# EasyEDA Pro project comparatorVCO.eprj, board PCB2
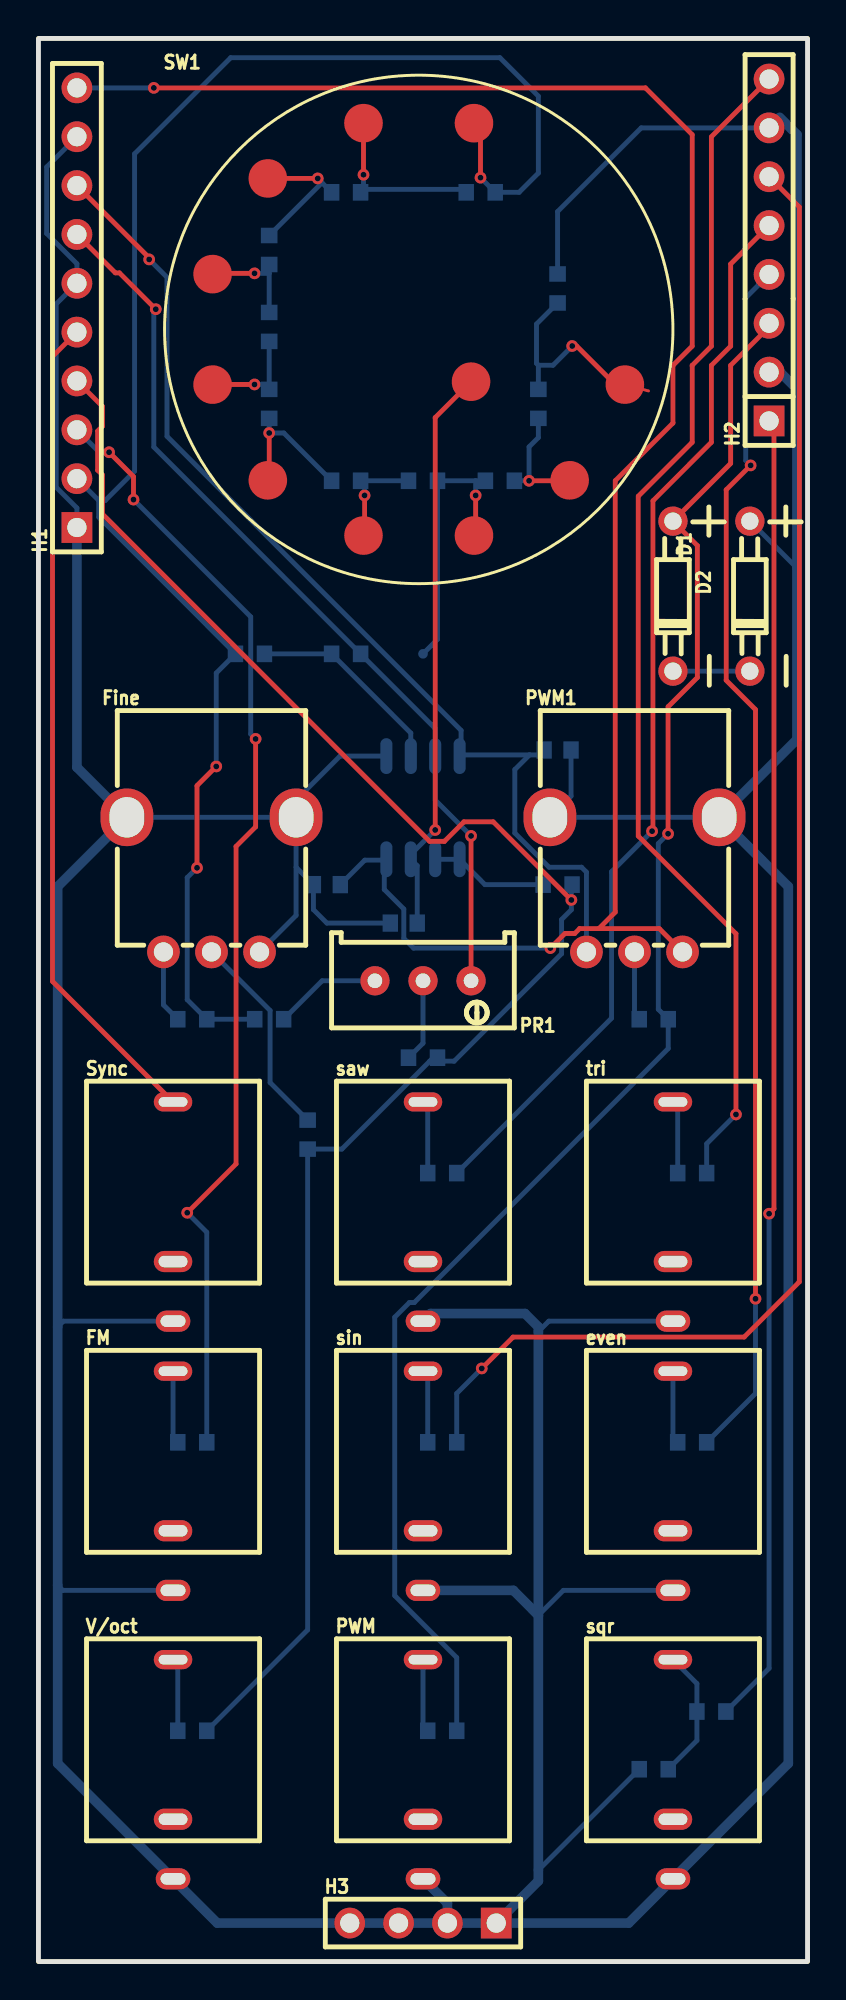
[diagram p6: board, top side]
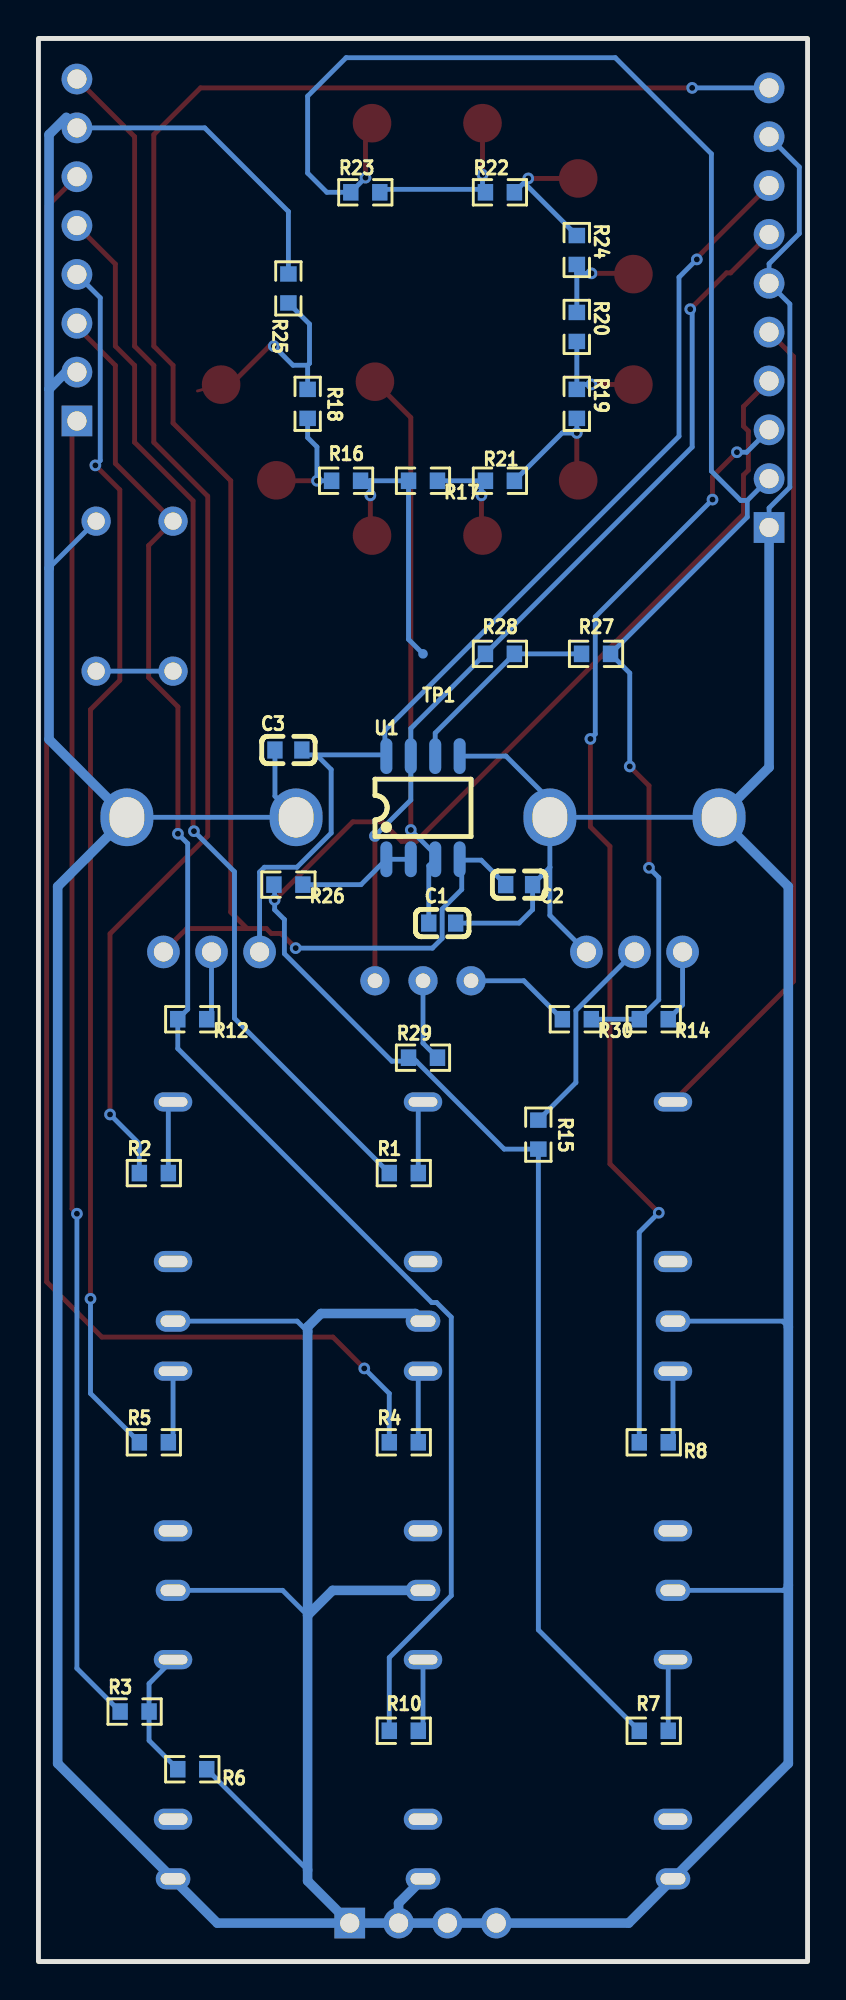
[diagram p7: board, bottom side, seen from below]

Outline 40 x 100 mm; copper layers: Top Layer, Bottom Layer. Coordinates in mm from the lower left corner of the outline.
Outline path: rectangle 0,100 40,0
Stack: Top Layer 0.035mm / Dielectric1 1.51mm FR4 er 4.5 / Bottom Layer 0.035mm

## Design rules (mm)
template: Custom Config
spacing copperThickness1oz (default): track to track 0.102, other pairs 0.152 to 0.3
spacing copperThickness2oz: track to track 0.203, other pairs 0.152 to 0.3
track width copperThickness1oz (default): min 0.127, default 0.254, max 2.54
track width copperThickness2oz: min 0.203, default 0.254, max 2.54
differential pair differentialPair (default): width min 0.127, default 0.254, max 2.54; gap min 0.152, default 0.152
via viaSize (default): diameter min 0.5, default 0.61, max 10; hole min 0.3, default 0.305, max 6.3

## Placement (name value [footprint] x y rotation side)
C1  1nF  [C0603]  19 54 180 bottom
C2  100nF  [C0603]  15 56 0 bottom
C3  100nF  [C0603]  27 63 180 bottom
D1  BZX55C4V7-TAP  [DO-35_BD1.7-L3.8-P7.8-D0.5-FD]  33 71 270 top
D2  BZX55C4V7-TAP  [DO-35_BD1.7-L3.8-P7.8-D0.5-FD]  37 71 270 top
even  WQP-WQP518MA  [CONN-TH_WQP-WQP518MA]  33 25 0 top
Fine  100kΩ  [RES-ADJ-TH_RK09D1130C3C]  9 56 0 top
FM  WQP-WQP518MA  [CONN-TH_WQP-WQP518MA]  7 25 0 top
H1  HTSW-110-07-G-S  [HDR-TH_TSW-110-17-F-S-LL]  2 86 90 top
H2  HTSW-108-22-T-S  [HDR-TH_HTSW-108-22-T-S]  38 89 90 top
H3  HTSW-104-18-F-S  [HDR-TH_HTSW-104-25-S-S-LL]  20 2 0 top
PR1  10kΩ  [RES-ADJ-TH_3P-L10.0-W10.0-P2.50-L]  20 51 180 top
PWM  WQP-WQP518MA  [CONN-TH_WQP-WQP518MA]  20 10 0 top
PWM1  100kΩ  [RES-ADJ-TH_RK09D1130C3C]  31 56 0 top
R1  1k  [R0603]  21 41 180 bottom
R2  1k  [R0603]  34 41 180 bottom
R3  3.3k  [R0603]  35 13 180 bottom
R4  1k  [R0603]  21 27 180 bottom
R5  1k  [R0603]  34 27 180 bottom
R6  3.3k  [R0603]  32 10 0 bottom
R7  100k 0.1%  [R0603]  8 12 0 bottom
R8  100K  [R0603]  8 27 0 bottom
R10  47k  [R0603]  21 12 0 bottom
R12  12k  [R0603]  32 49 0 bottom
R14  130k  [R0603]  8 49 180 bottom
R15  100k  [R0603]  14 43 270 bottom
R16  120R 0.1%  [R0603]  24 77 0 bottom
R17  120R 0.1%  [R0603]  20 77 0 bottom
R18  120R 0.1%  [R0603]  26 81 90 bottom
R19  120R 0.1%  [R0603]  12 81 270 bottom
R20  120R 0.1%  [R0603]  12 85 270 bottom
R21  120R 0.1%  [R0603]  16 77 0 bottom
R22  120R 0.1%  [R0603]  16 92 180 bottom
R23  120R 0.1%  [R0603]  23 92 180 bottom
R24  120R 0.1%  [R0603]  12 89 270 bottom
R25  120R 0.1%  [R0603]  27 87 90 bottom
R26  50k .1%  [R0603]  27 56 0 bottom
R27  10K  [R0603]  11 68 0 bottom
R28  10K  [R0603]  16 68 0 bottom
R29  100k  [R0603]  20 47 180 bottom
R30  36k  [R0603]  12 49 0 bottom
saw  WQP-WQP518MA  [CONN-TH_WQP-WQP518MA]  20 39 0 top
sin  WQP-WQP518MA  [CONN-TH_WQP-WQP518MA]  20 25 0 top
sqr  WQP-WQP518MA  [CONN-TH_WQP-WQP518MA]  33 10 0 top
SW1  10polbryter, sjekk rett komponent  [A11003RNCQ_CNK]  30.5 82 0 top
Sync  WQP-WQP518MA  [CONN-TH_WQP-WQP518MA]  7 39 0 top
TP1  -  [Test-Point-0.5mm]  20 68 180 bottom
tri  WQP-WQP518MA  [CONN-TH_WQP-WQP518MA]  33 39 0 top
U1  TL082  [SOP-8_L4.9-W3.9-P1.27-LS6.0-BL]  20 60 180 bottom
V/oct  WQP-WQP518MA  [CONN-TH_WQP-WQP518MA]  7 10 0 top

## Footprints (pads in the part's own frame, mm; a bottom-side part is the same pattern mirrored in y, then rotated)
A11003RNCQ_CNK
  round 2.006 smd: 0(-8.001,0.152) 1(0,0) 2(-2.873,-4.976) 3(-7.848,-7.848) 4(-13.595,-7.848) 5(-18.57,-4.976) 6(-21.443,0) 7(-21.443,5.745) 8(-18.57,10.722) 9(-13.595,13.595) 10(-7.848,13.595)
C0603
  rect 0.8x0.9 smd: 1(-0.7,0) 2(0.7,0)
CONN-TH_WQP-WQP518MA
  oval 1.8x1.1 hole 1.3x0.6: 1(0,-5.7)
  oval 2x1.1 hole 1.5x0.6: 2(0,-2.6)
  oval 2x1 hole 1.5x0.5: 3(0,5.7)
DO-35_BD1.7-L3.8-P7.8-D0.5-FD
  round 1.524 hole 0.9: 1(3.9,0) 2(-3.9,0)
HDR-TH_HTSW-104-25-S-S-LL
  rect 1.6x1.6 hole 1: 1(3.81,0)
  round 1.6 hole 1: 2(1.27,0) 3(-1.27,0) 4(-3.81,0)
HDR-TH_HTSW-108-22-T-S
  rect 1.6x1.6 hole 1: 1(-8.89,0)
  round 1.6 hole 1: 2(-6.35,0) 3(-3.81,0) 4(-1.27,0) 5(1.27,0) 6(3.81,0) 7(6.35,0) 8(8.89,0)
HDR-TH_TSW-110-17-F-S-LL
  rect 1.6x1.6 hole 1: 1(-11.43,0)
  round 1.6 hole 1: 2(-8.89,0) 3(-6.35,0) 4(-3.81,0) 5(-1.27,0) 6(1.27,0) 7(3.81,0) 8(6.35,0) 9(8.89,0) 10(11.43,0)
R0603
  rect 0.806x0.864 smd: 1(-0.753,0) 2(0.753,0)
RES-ADJ-TH_3P-L10.0-W10.0-P2.50-L
  round 1.524 hole 0.762: 1(-2.5,0) 2(0,0) 3(2.5,0)
RES-ADJ-TH_RK09D1130C3C
  round 1.7 hole 1: 1(-2.5,-3.5) 2(0,-3.5) 3(2.5,-3.5)
  oval 2.75x3 hole 1.8x2.1: 4(-4.4,3.5) 5(4.4,3.5)
SOP-8_L4.9-W3.9-P1.27-LS6.0-BL
  oval 0.63x1.865 smd: 1(-1.905,-2.683) 2(-0.635,-2.683) 3(0.635,-2.683) 4(1.905,-2.683) 5(1.905,2.683) 6(0.635,2.683) 7(-0.635,2.683) 8(-1.905,2.683)
Test-Point-0.5mm
  round 0.5 smd: 1(0,0)

## Nets
As in the schematic, except:
GND: C1.2 C2.1 C3.1 D2.2 even.1 Fine.3 Fine.4 Fine.5 FM.1 H1.1 H1.6 H1.9 H2.2 H2.7 H3.1 H3.2 H3.3 H3.4 PWM.1 PWM1.4 PWM1.5 R6.1 R25.2 saw.1 sin.1 sqr.1 Sync.1 tri.1 U1.5 V/oct.1

Pads without a net: even 2; FM 2; PWM 2; saw 2; sin 2; sqr 2; Sync 2; tri 2; V/oct 2

## Via types
v1: diameter 0.61, hole 0.305, Top Layer to Bottom Layer, 30 vias

## Routing (per net, layer and track width the routed paths; a pad name or vN(x,y) marks a point on that pad's centre or on a via; arc(x,y) is an arc through that point)
+12V: length 55.5
  Top Layer w0.254: v1(5.76,88.51) 5.76,88.59 H1.8
  Bottom Layer w0.254: 25.54,62.75 26.05,62.75 C3.2 ; 25.54,62.75 24.78,61.98 24.78,58.68 26.55,56.9 28.25,56.9 28.5,56.65 PWM1.1 ; 25.54,62.75 21.98,62.75 ; 21.98,62.75 21.98,64.02 6.69,79.31 6.69,87.58 v1(5.76,88.51) ; 21.98,62.75 U1.8
-12V: length 99.4
  Top Layer w0.254: PWM1.3 32.29,53.71 29.15,53.71 ; 29.15,53.71 30,54.57 30,77 33,80 33,83 34,84 34,95 31.57,97.43 v1(6,97.43) ; 29.15,53.71 28.15,53.71 27.89,53.46 27.38,53.46 v1(26.62,52.7)
  Bottom Layer w0.254: v1(26.62,52.7) 19.51,52.7 19,53.21 19,54.73 17.99,55.75 17.99,57.27 ; 17.99,57.27 16.97,57.27 C2.2 ; 17.99,57.27 U1.4 ; H1.10 v1(6,97.43)
GND: length 369.6
  Bottom Layer w0.254: C1.2 15,54 14.3,54.7 C2.1 13.4,56.9 ; C3.1 27.7,60.6 PWM1.4 PWM1.5 ; R6.1 26,4.75 ; D2.2 37.01,74.9 39.45,72.46 ; 26,18 27.3,19.3 even.1 ; 13.4,56.9 Fine.5 ; 13.4,56.9 13.4,54.4 Fine.3 ; Fine.5 Fine.4 ; Fine.5 13.4,60.4 15.68,62.68 U1.5 ; Sync.1 1.3,33.3 1,33 ; H1.9 0.43,93.32 0.43,89.86 2,88.28 H1.6 0.92,86.19 0.92,76.66 2,75.58 H1.1 ; FM.1 1.26,19.3 1,19.56 ; tri.1 26.54,33.3 26,32.76 ; R25.2 27,91 31.35,95.35 H2.7
  Bottom Layer w0.5: 39.45,81.77 38.57,82.65 H2.2 ; 39.45,81.77 39.45,63.55 PWM1.5 39,55.9 39,10.3 sqr.1 30.7,2 H3.1 ; 39.45,81.77 39.45,95 38.55,95.9 ; PWM.1 21.27,3.03 H3.2 ; H3.2 H3.1 ; H3.2 H3.3 H3.4 9.3,2 V/oct.1 1,10.3 1,55.9 Fine.4 2,62.1 H1.1 ; saw.1 20.4,33.7 25.3,33.7 26,33 26,18 ; 26,18 26,4.19 H3.1 ; 26,18 24.7,19.3 sin.1
-V_REF: length 47.5
  Top Layer w0.254: v1(6.1,85.92) 4.21,87.81 4,87.81 H1.7 ; v1(22.5,58.53) PR1.1
  Bottom Layer w0.254: v1(6.1,85.92) 6,85.82 6,78.75 R28.2 20.63,64.12 U1.7 20.63,60.4 v1(22.5,58.53)
EVEN_OUT: length 63.5
  Top Layer w0.254: v1(37.29,34.46) 37.29,65.1 35.77,66.62 35.77,76.53 v1(37.04,77.8)
  Bottom Layer w0.254: R5.1 37.29,29.54 v1(37.29,34.46) ; H2.4 36.79,86.52 36.79,78.05 v1(37.04,77.8)
FM_IN: length 58.7
  Top Layer w0.254: v1(7.74,38.94) 10.28,41.48 10.28,57.99 11.29,59 v1(11.29,63.58) ; v1(4.94,76.02) 4.94,77.21 v1(3.67,78.48)
  Bottom Layer w0.254: v1(4.94,76.02) 11.04,69.93 11.04,63.83 v1(11.29,63.58) ; H1.3 3.17,78.48 v1(3.67,78.48) ; v1(7.74,38.94) 8.75,37.92 R8.2
PW_IN: length 84.2
  Top Layer w0.254: v1(32.75,58.64) 32.75,65.25 34.27,66.77 34.27,73.63 D1.2 36,77.9 36,83 38,85 H2.3
  Bottom Layer w0.254: v1(32.75,58.64) 32.24,58.14 32.24,49.52 R12.2 32.75,47.48 19.55,34.27 19.29,34.27 18.53,33.51 18.53,19.03 21.75,15.8 R10.2
PW_OUT: length 68.3
  Top Layer w0.254: H2.1 38.25,79.86 38.25,39.14 v1(38,38.89)
  Bottom Layer w0.254: v1(38,38.89) 38,15.25 R3.1
SAW_OUT: length 56
  Top Layer w0.254: H2.5 36,88.27 36,84 35,83 35,79 31.96,75.96 31.96,58.83 v1(31.91,58.78)
  Bottom Layer w0.254: R1.1 29.81,49.05 29.81,56.67 v1(31.91,58.78)
SIN_OUT: length 80.9
  Top Layer w0.254: v1(23.06,30.84) 24.68,32.47 36.7,32.47 39.57,35.34 39.57,91.24 H2.6
  Bottom Layer w0.254: R4.1 21.75,29.54 v1(23.06,30.84)
SYNC: length 43.2
  Top Layer w0.254: H1.5 0.73,83.46 0.73,50.97 Sync.3
TRI_OUT: length 62.4
  Top Layer w0.254: H2.8 35,94.89 35,84 34,83 34,79 31.2,76.2 31.2,58.53 36.28,53.45 v1(36.28,44.05)
  Bottom Layer w0.254: v1(36.28,44.05) 34.75,42.52 R2.1
V_OCT_IN: length 95.4
  Top Layer w0.254: v1(27.72,55.2) 23.65,59.26 22.13,59.26 21.11,58.25 20.35,58.25 3.33,75.27 3.33,77.3 3.08,77.55 3.08,79.58 3.33,79.84 3.33,80.86 H1.4
  Bottom Layer w0.254: R26.2 27.72,55.96 v1(27.72,55.2) 27.72,54.69 27.21,54.18 27.21,52.41 21.62,46.82 20.35,46.82 ; 20.35,46.82 15.78,42.25 R15.2 14,17.25 R7.2 ; 20.35,46.82 20.53,47 R29.1
V_REF: length 89.1
  Top Layer w0.254: v1(22.99,92.76) 22.99,95.25 SW1.10 ; v1(8.25,56.88) 8.25,61.14 v1(9.25,62.14)
  Bottom Layer w0.254: v1(8.25,56.88) 7.74,56.37 7.74,50.02 R14.1 R30.1 ; 3.13,75.98 3.47,75.98 5,77.5 5,94 10,99 24,99 26,97 26,93 25,92 R23.1 v1(22.99,92.76) ; 3.13,75.98 3.13,75.11 R27.1 9.25,67 v1(9.25,62.14) ; 3.13,75.98 H1.2
$1N379: length 3.8
  Bottom Layer w0.254: R1.2 20.25,44.45 saw.3
$1N459: length 3.8
  Bottom Layer w0.254: tri.3 33.25,44.45 R2.2
$1N485: length 6.8
  Bottom Layer w0.254: sqr.3 34.25,14.45 R3.2 34.25,11.49 R6.2
$1N511: length 3.8
  Bottom Layer w0.254: R4.2 20.25,30.45 sin.3
$1N537: length 3.8
  Bottom Layer w0.254: even.3 33,27.25 R5.2
$1N977: length 3.8
  Bottom Layer w0.254: V/oct.3 7.25,15.45 R7.1
$1N1003: length 3.8
  Bottom Layer w0.254: R8.1 7,27.25 FM.3
$1N1055: length 3.8
  Bottom Layer w0.254: R10.1 20,12.25 PWM.3
$1N1199: length 3.6
  Bottom Layer w0.254: PWM1.2 31,49.25 R12.1
$1N1336: length 4
  Bottom Layer w0.254: D1.1 D2.1
$1N1602: length 3.8
  Bottom Layer w0.254: Fine.1 6.5,49.75 R14.2
$1N1651: length 10.8
  Bottom Layer w0.254: R15.1 12.05,45.71 12.05,49.45 Fine.2
$1N1895: length 6.3
  Top Layer w0.254: SW1.2 27.6,77 v1(25.52,77)
  Bottom Layer w0.254: R18.1 26,79.25 25.52,78.76 v1(25.52,77) R16.2
$1N1897: length 14.7
  Top Layer w0.254: SW1.3 22.74,74.24 v1(22.74,76.24)
  Bottom Layer w0.254: TP1.1 20.75,68.75 R17.2 22.74,77 ; R16.1 22.74,77 ; 22.74,77 v1(22.74,76.24)
$1N1971: length 7.5
  Top Layer w0.254: v1(12,79.48) 12,77.09 SW1.5
  Bottom Layer w0.254: R19.2 v1(12,79.48) 12.76,79.48 R21.1
$1N1973: length 5.4
  Top Layer w0.254: SW1.6 9.06,82.01 v1(11.24,82.01)
  Bottom Layer w0.254: 12,82.01 R20.2 ; 12,82.01 R19.1 ; 12,82.01 v1(11.24,82.01)
$1N1975: length 5.4
  Top Layer w0.254: v1(16.96,76.24) 16.96,74.21 SW1.4
  Bottom Layer w0.254: 16.96,77 R21.2 ; 16.96,77 R17.1 ; 16.96,77 v1(16.96,76.24)
$1N2049: length 7.5
  Top Layer w0.254: v1(14.53,92.72) SW1.8
  Bottom Layer w0.254: R22.2 14.74,92.51 ; 14.74,92.51 v1(14.53,92.72) ; 14.74,92.51 14.74,92.49 R24.1
$1N2051: length 9.1
  Top Layer w0.254: v1(16.91,92.91) SW1.9
  Bottom Layer w0.254: R23.2 22.09,92.15 16.91,92.15 ; R22.1 16.91,92.15 ; 16.91,92.15 v1(16.91,92.91)
$1N2053: length 5.5
  Top Layer w0.254: SW1.7 9.1,87.79 v1(11.24,87.79)
  Bottom Layer w0.254: 12,87.79 v1(11.24,87.79) ; 12,87.79 R20.1 ; 12,87.79 R24.2
$1N2228: length 10.6
  Top Layer w0.254: v1(27.76,84.01) 27.99,84.01 30.25,81.75
  Bottom Layer w0.254: R18.2 26,83.01 ; 26,83.01 26.76,83.01 v1(27.76,84.01) ; 26,83.01 25.9,83.1 25.9,85.15 R25.1
$1N2423: length 29.6
  Top Layer w0.254: v1(20.63,58.84) 20.63,80.29 SW1.0
  Bottom Layer w0.254: v1(20.63,58.84) 19.37,57.57 U1.3 19.7,56.98 C1.1
$1N2918: length 10.5
  Bottom Layer w0.254: R27.2 R28.1 19.37,63.88 U1.6
$1N3569: length 6.2
  Bottom Layer w0.254: R26.1 23.22,56 U1.1 U1.2
$1N5861: length 4.3
  Bottom Layer w0.254: R29.2 20,47.75 PR1.2
$1N5947: length 5.6
  Bottom Layer w0.254: R30.2 14.75,51 PR1.3
